# Altium schematic sheet TMC2660_driver.SchDoc: RP2040 CNC
size B; Author: AM; CompanyName: Expatria Technologies; DrawnBy: A.Marles; Engineer: AM; Organization: Expatria Technolgoies; Address1: PO Box 2084; Address3: Merritt, BC V1K 1B8; Address4: Canada; DocumentNumber: 12; SheetNumber: 9; SheetTotal: 26
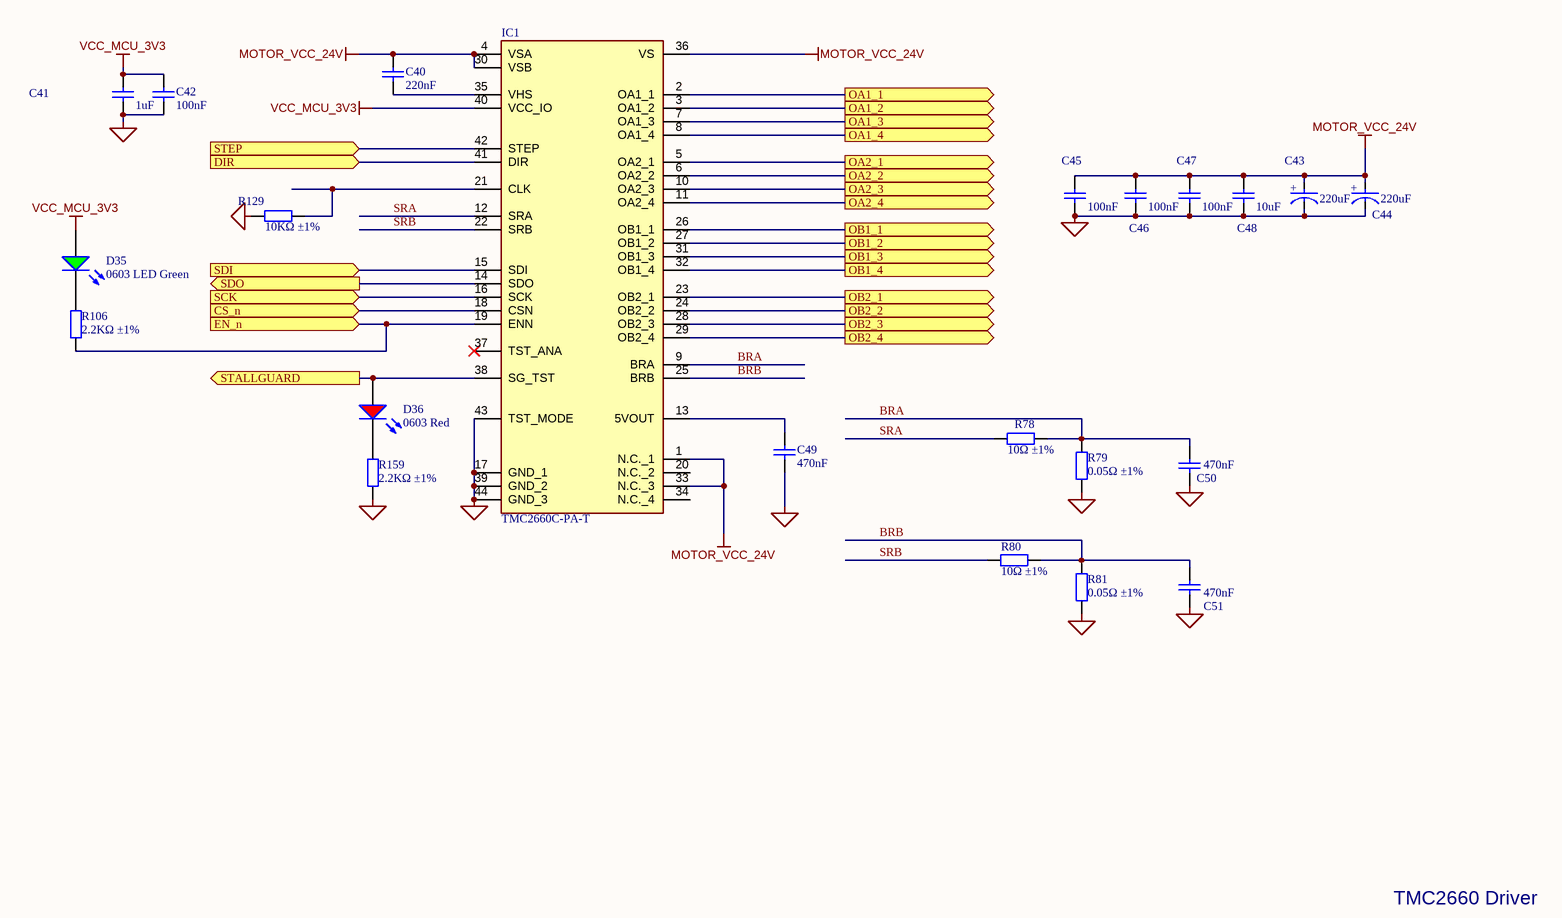
[diagram p0: TMC2660_driver.SchDoc]

## Parts
C40  220nF  [0603_C]
C41  1uF  [0603_C]
C42  100nF  [0603_C]
C43  220uF  [FP-FKG-MFG]
C44  220uF  [FP-FKG-MFG]
C45  100nF  [0603_C]
C46  100nF  [0603_C]
C47  100nF  [0603_C]
C48  10uF  [0805_C]
C49  470nF  [0603_C]
C50  470nF  [0603_C]
C51  470nF  [0603_C]
D35  0603 LED Green  [0603_LED_S1 - GREEN]
D36  0603 Red  [0603_LED_S1]
IC1  TMC2660C-PA-T  [QFP80P1200X1200X160-44N]
R78  10Ω ±1%  [0603_R]
R79  0.05Ω ±1%  [1206_R]
R80  10Ω ±1%  [0603_R]
R81  0.05Ω ±1%  [1206_R]
R106  2.2KΩ ±1%  [0402_R]
R129  10KΩ ±1%  [0603_R]
R159  2.2KΩ ±1%  [0402_R]

## Ports
CS_n (in), DIR (in), EN_n (in), OA1_1 (out), OA1_2 (out), OA1_3 (out), OA1_4 (out), OA2_1 (out), OA2_2 (out), OA2_3 (out), OA2_4 (out), OB1_1 (out), OB1_2 (out), OB1_3 (out), OB1_4 (out), OB2_1 (out), OB2_2 (out), OB2_3 (out), OB2_4 (out), SCK (in), SDI (in), SDO (out), STALLGUARD (out), STEP (in)

## Nets
MCU_GND: C41.1 C42.2 C43.1(C) C44.1(C) C45.2 C46.2 C47.2 C48.1 C49.1 C50.2 C51.2 IC1.17(GND_1) IC1.39(GND_2) IC1.43(TST_MODE) IC1.44(GND_3) R79.1 R81.1 R129.2 R159.1
MOTOR_VCC_24V: C40.2 C43.2(A) C44.2(A) C45.1 C46.1 C47.1 C48.2 IC1.1(N.C._1) IC1.4(VSA) IC1.30(VSB) IC1.33(N.C._3) IC1.36(VS)
VCC_MCU_3V3: C41.2 C42.1 D35.A IC1.40(VCC_IO)
BRA: C50.1 IC1.9(BRA) R78.2 R79.2
BRB: C51.1 IC1.25(BRB) R80.2 R81.2
CS_n: IC1.18(CSN) ; port CS_n
DIR: IC1.41(DIR) ; port DIR
EN_n: IC1.19(ENN) R106.1 ; port EN_n
OA1_1: IC1.2(OA1_1) ; port OA1_1
OA1_2: IC1.3(OA1_2) ; port OA1_2
OA1_3: IC1.7(OA1_3) ; port OA1_3
OA1_4: IC1.8(OA1_4) ; port OA1_4
OA2_1: IC1.5(OA2_1) ; port OA2_1
OA2_2: IC1.6(OA2_2) ; port OA2_2
OA2_3: IC1.10(OA2_3) ; port OA2_3
OA2_4: IC1.11(OA2_4) ; port OA2_4
OB1_1: IC1.26(OB1_1) ; port OB1_1
OB1_2: IC1.27(OB1_2) ; port OB1_2
OB1_3: IC1.31(OB1_3) ; port OB1_3
OB1_4: IC1.32(OB1_4) ; port OB1_4
OB2_1: IC1.23(OB2_1) ; port OB2_1
OB2_2: IC1.24(OB2_2) ; port OB2_2
OB2_3: IC1.28(OB2_3) ; port OB2_3
OB2_4: IC1.29(OB2_4) ; port OB2_4
SCK: IC1.16(SCK) ; port SCK
SDI: IC1.15(SDI) ; port SDI
SDO: IC1.14(SDO) ; port SDO
SRA: IC1.12(SRA) R78.1
SRB: IC1.22(SRB) R80.1
STALLGUARD: D36.A IC1.38(SG_TST) ; port STALLGUARD
STEP: IC1.42(STEP) ; port STEP
NetC40_1: C40.1 IC1.35(VHS)
NetC49_2: C49.2 IC1.13(5VOUT)
NetD35_K: D35.K R106.2
NetD36_K: D36.K R159.2
NetIC1_21: IC1.21(CLK) R129.1

Not connected (* = marked no-connect by the designer): IC1 20(N.C._2) 34(N.C._4) 37(TST_ANA)*

## Notes on the sheet
- TMC2660 Driver
- SHEET
- Expatria Technologies
- PO Box 2084
- Merritt, BC V1K 1B8
- PHONE: (778) 238-9336
- PROJECT
- SIZE
- ENGR
- MODIFIED
- DOCUMENT
- REV
- Copyright Expatria Technologies 2022. This document describes Open Hardware and is licensed under the CERN-OHL-S v2. No warranty is implied or expressed.
- EMAIL: info@expatria.ca
- B
- /
- (in symbol UUD1H221MNL1GS) +

## Library data of the parts
C40 = 0603 220nF (224) 10% 25V: Chip capacitors; Manufacturer: Samsung Electro-Mechanics; Manufacturer Part Number: CL10B224KA8NNNC; Tolerance: 10%; Voltage: 25V; ComponentLink1Description: Supplier link; ComponentLink1URL: http://www.szlcsc.com/product/details_21832.html; Package: 0603; Supplier: LCSC; SuppliersPartNumber: C21120; Capacitance: 220nF
C41 = 0603 1uF (105) 10% 50V: Chip capacitors; Manufacturer: Samsung Electro-Mechanics; Manufacturer Part Number: CL10A105KB8NNNC; Tolerance: 10%; Voltage: 50V; ComponentLink1Description: Supplier link; ComponentLink1URL: http://www.szlcsc.com/product/details_16531.html; Package: 0603; Supplier: LCSC; SuppliersPartNumber: C15849; Capacitance: 1uF
C42 C45-C47 = 0603 100nF (104) 10% 50V: 50V 100nF X7R ±10% 0603 Multilayer Ceramic Capacitors MLCC - SMD/SMT ROHS; Manufacturer: YAGEO; Manufacturer Part Number: CC0603KRX7R9BB104; ComponentLink1Description: Supplier link; ComponentLink1URL: http://www.szlcsc.com/product/details_15331.html; Package: 0603; Supplier: LC; SuppliersPartNumber: C14663; Capacitance: 100nF; Tolerance: 10%; Voltage: 50V
C43 C44 = UUD1H221MNL1GS: CAP ALUM 220UF 20% 50V SMD; Manufacturer: Nichicon; Material: Aluminum; Life: 2000Hours; Esr: 0.18Ω; Automotive Grade: Grade 2; Dissipation Factor: 10%; Tolerance: 20%; Device Class L3: Aluminum Electrolytic Capacitors; ComponentLink2Description: Datasheet; Temperature Range High: +105°C; Digikey Description: CAP ALUM 220UF 20% 50V SMD; Height: 10.5mm; Voltage Rating: 50V; Value: 220uF; Capacitance: 220uF; Automotive: Yes; ComponentLink2URL: https://industrial.panasonic.com/cdbs/www-data/pdf/RDE0000/ABA0000C1181.pdf; Package: FKG; Device Class L2: Capacitors; Lead Free: Yes; Device Class L1: Passive Components; Manufacturer Part Number: UUD1H221MNL1GS; SuppliersPartNumber: C125976; Supplier: LCSC
C48 = 0805 10uF (106) 10% 25V: Chip capacitors; Manufacturer: Samsung Electro-Mechanics; Manufacturer Part Number: CL21A106KAYNNNE; Tolerance: 10%; Voltage: 25V; ComponentLink1Description: Supplier link; ComponentLink1URL: http://www.szlcsc.com/product/details_16532.html; Package: 0805; Supplier: LCSC; SuppliersPartNumber: C15850; Capacitance: 10uF
C49-C51 = 0603 470nF (474) 10% 25V: Chip capacitors; Manufacturer: Samsung Electro-Mechanics; Manufacturer Part Number: CL10B474KA8NNNC; Tolerance: 10%; Voltage: 25V; ComponentLink1Description: Supplier link; ComponentLink1URL: http://www.szlcsc.com/product/details_1975.html; Package: 0603; SuppliersPartNumber: C1623; Capacitance: 470nF
  C49: Supplier: LCSC
  C50 C51: Supplier: LC
D35 = 19-217/GHC-YR1S2/3T: Colorless transparence -40℃~+85℃ 520nm~535nm Emerald 120° 110mW 0603 Light Emitting Diodes (LED) ROHS; Manufacturer: Everlight Elec; Package: 0603; Supplier: LC; SuppliersPartNumber: C72043; Color: Green; Manufacturer Part Number: 19-217/GHC-YR1S2/3T
D36 = 19-213SURC/S530-A3/TR8: 20mA 632nm Colorless transparence 624nm~624nm -40℃~+85℃ Red 120° 60mW 0603 Light Emitting Diodes (LED) ROHS; Manufacturer: Everlight Elec; Package: 0603; Supplier: LC; SuppliersPartNumber: C72039; Color: Red; ComponentLink1Description: 供应商链接; ComponentLink1URL: http://www.szlcsc.com/product/details_2659.html; Supplier 1: LC; Supplier Part Number 1: C72039; Manufacturer Part Number: 19-213SURC/S530-A3/TR8
IC1 = TMC2660C-PA-T: QFP-44 Motor Driver ICs ROHS; Manufacturer_Name: TRINAMIC; Manufacturer_Part_Number: TMC2660C-PA-T; SuppliersPartNumber: C2927052; Supplier: LCSC; Manufacturer: TRINAMIC; Manufacturer Part Number: TMC2660C-PA-T
R78 R80 = 0603 10R (10R0) 1%: Chip resistor; Manufacturer: Uniroyal Elec; Manufacturer Part Number: 0603WAF100JT5E; Power: 1/10W; ComponentLink1Description: Supplier link; ComponentLink1URL: http://www.szlcsc.com/product/details_23586.html; Package: 0603; Supplier: LCSC; SuppliersPartNumber: C22859; Resistance: 10Ω; Tolerance: 1%
R79 R81 = 1206 0.05R (R50) 1%: 1W ±100ppm/℃ ±1% 50mΩ 1206 Chip Resistor - Surface Mount ROHS; Manufacturer: YAGEO; Manufacturer Part Number: PA1206FRF470R05L; Resistance: 0.05; ComponentLink1Description: Supplier link; ComponentLink1URL: http://www.szlcsc.com/product/details_26077.html; Package: 1206; Supplier: LC; SuppliersPartNumber: C728294; Power: 1W; Tolerance: 1%
R106 R159 = 0402 2.2K (2201) 1%: Chip resistor; Manufacturer: Uniroyal Elec; Manufacturer Part Number: 0402WGF2201TCE; Power: 1/16W; ComponentLink1Description: Supplier link; ComponentLink1URL: http://www.szlcsc.com/product/details_26622.html; Package: 0402; Supplier: LC; SuppliersPartNumber: C25879; Resistance: 2.2KΩ; Tolerance: 1%
R129 = 0603 10K (1002) 1%: Chip resistor; Manufacturer: Uniroyal Elec; Manufacturer Part Number: 0603WAF1002T5E; Power: 1/10W; Package: 0603; Supplier: LCSC; SuppliersPartNumber: C25804; Resistance: 10KΩ; Tolerance: 1%; ComponentLink1Description: Supplier link; ComponentLink1URL: http://www.szlcsc.com/product/details_26547.html